# Altium schematic sheet Single Pulse Gen.SchDoc
size A4; DrawnBy: S. Saejia; Address1: L3, 12a Rodborough Rd; Address2: Frenchs Forest; Address3: NSW; Address4: Australia 2086
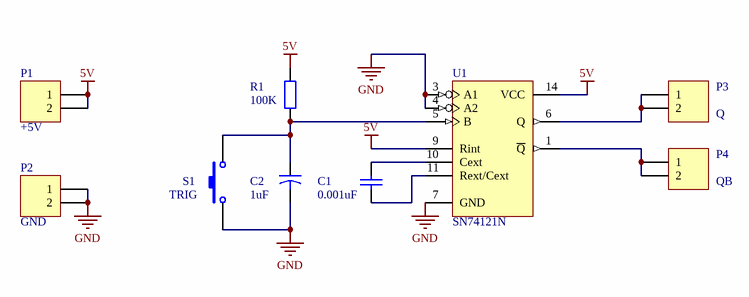
[diagram p0: Single Pulse Gen.SchDoc]

## Parts
C1  0.001uF  [RAD-0.1]
C2  1uF  [CAPPR2-5X11]
P1  +5V  [HDR1X2]
P2  GND  [HDR1X2]
P3  Q  [HDR1X2]
P4  QB  [HDR1X2]
R1  100K  [AXIAL-0.4]
S1  TRIG  [RESET SW]
U1  SN74121N  [N014]

## Nets
5V: P1.1 P1.2 R1.2 U1.9(Rint) U1.14(VCC)
GND: C2.2 P2.1 P2.2 S1.1 U1.3(A1) U1.4(A2) U1.7(GND)
NetC1_1: C1.1 U1.11(Rext/Cext)
NetC1_2: C1.2 U1.10(Cext)
NetC2_1: C2.1 R1.1 S1.2 U1.5(B)
NetP3_1: P3.1 P3.2 U1.6(Q)
NetP4_1: P4.1 P4.2 U1.1(~{Q})

## Notes on the sheet
- Title
- Size:
- Date:
- A4
- Number:
- Time:
- Revision:
- Sheet
- of
- Approved:
- ORG:
- Drawn:
- Checked:
- PRJ:
- File:

## Library data of the parts
C1 = Cap: Capacitor; Published: 8-Jun-2000; LatestRevisionDate: 17-Jul-2002; LatestRevisionNote: Re-released for DXP Platform.; PackageReference: RAD-0.3; Publisher: Altium Limited; PackageDescription: Radial Cap, Thru-Hole; 2 Leads; 0.3 in Pin Spacing; Value: 0.001uF
C2 = Cap2: Capacitor; Published: 23-Sep-2002; PackageReference: CAPR5-4X5; Publisher: Altium Limited; PackageDescription: Capacitor; 2 Leads; Value: 1uF
P1-P4 = Header 2: Header, 2-Pin; LatestRevisionDate: 17-Jul-2002; LatestRevisionNote: Re-released for DXP Platform.; Publisher: Altium Limited
R1 = Res2: Resistor; Published: 8-Jun-2000; LatestRevisionDate: 17-Jul-2002; LatestRevisionNote: Re-released for DXP Platform.; PackageReference: AXIAL-0.4; Publisher: Altium Limited; PackageDescription: Axial Device, Thru-Hole; 2 Leads; 0.4 in Pin Spacing; Value: 100K
S1 = SW-PB: Switch; Published: 24-Mar-1999; LatestRevisionDate: 17-Jul-2002; LatestRevisionNote: Re-released for DXP Platform.; PackageReference: SPST-2; Publisher: Altium Limited; PackageDescription: Switch; 2 Leads
U1 = SN74121N: Monostable Multivibrator with Schmitt-Trigger Inputs; Note: Pins No 2,8,12 and 13 are not connected and not drawn; Published: 8-Jun-2000; LatestRevisionDate: 04-Mar-2005; LatestRevisionNote: Stylized 3D Model Added.; DatasheetVersion: Mar-1988; PackageVersion: Oct-1995; PackageReference: N014; Publisher: Altium Limited; PackageDescription: DIP; 14 Leads; Row Spacing 7.62 mm; Pitch 2.54 mm; ComponentLink1Description: Manufacturer Link; ComponentLink1URL: http://www.ti.com/; ComponentLink2Description: Datasheet; ComponentLink2URL: http://www-s.ti.com/sc/ds/sn74121.pdf